# Altium project KeepTalking_PCB.PrjPcb (part 1 of 3)
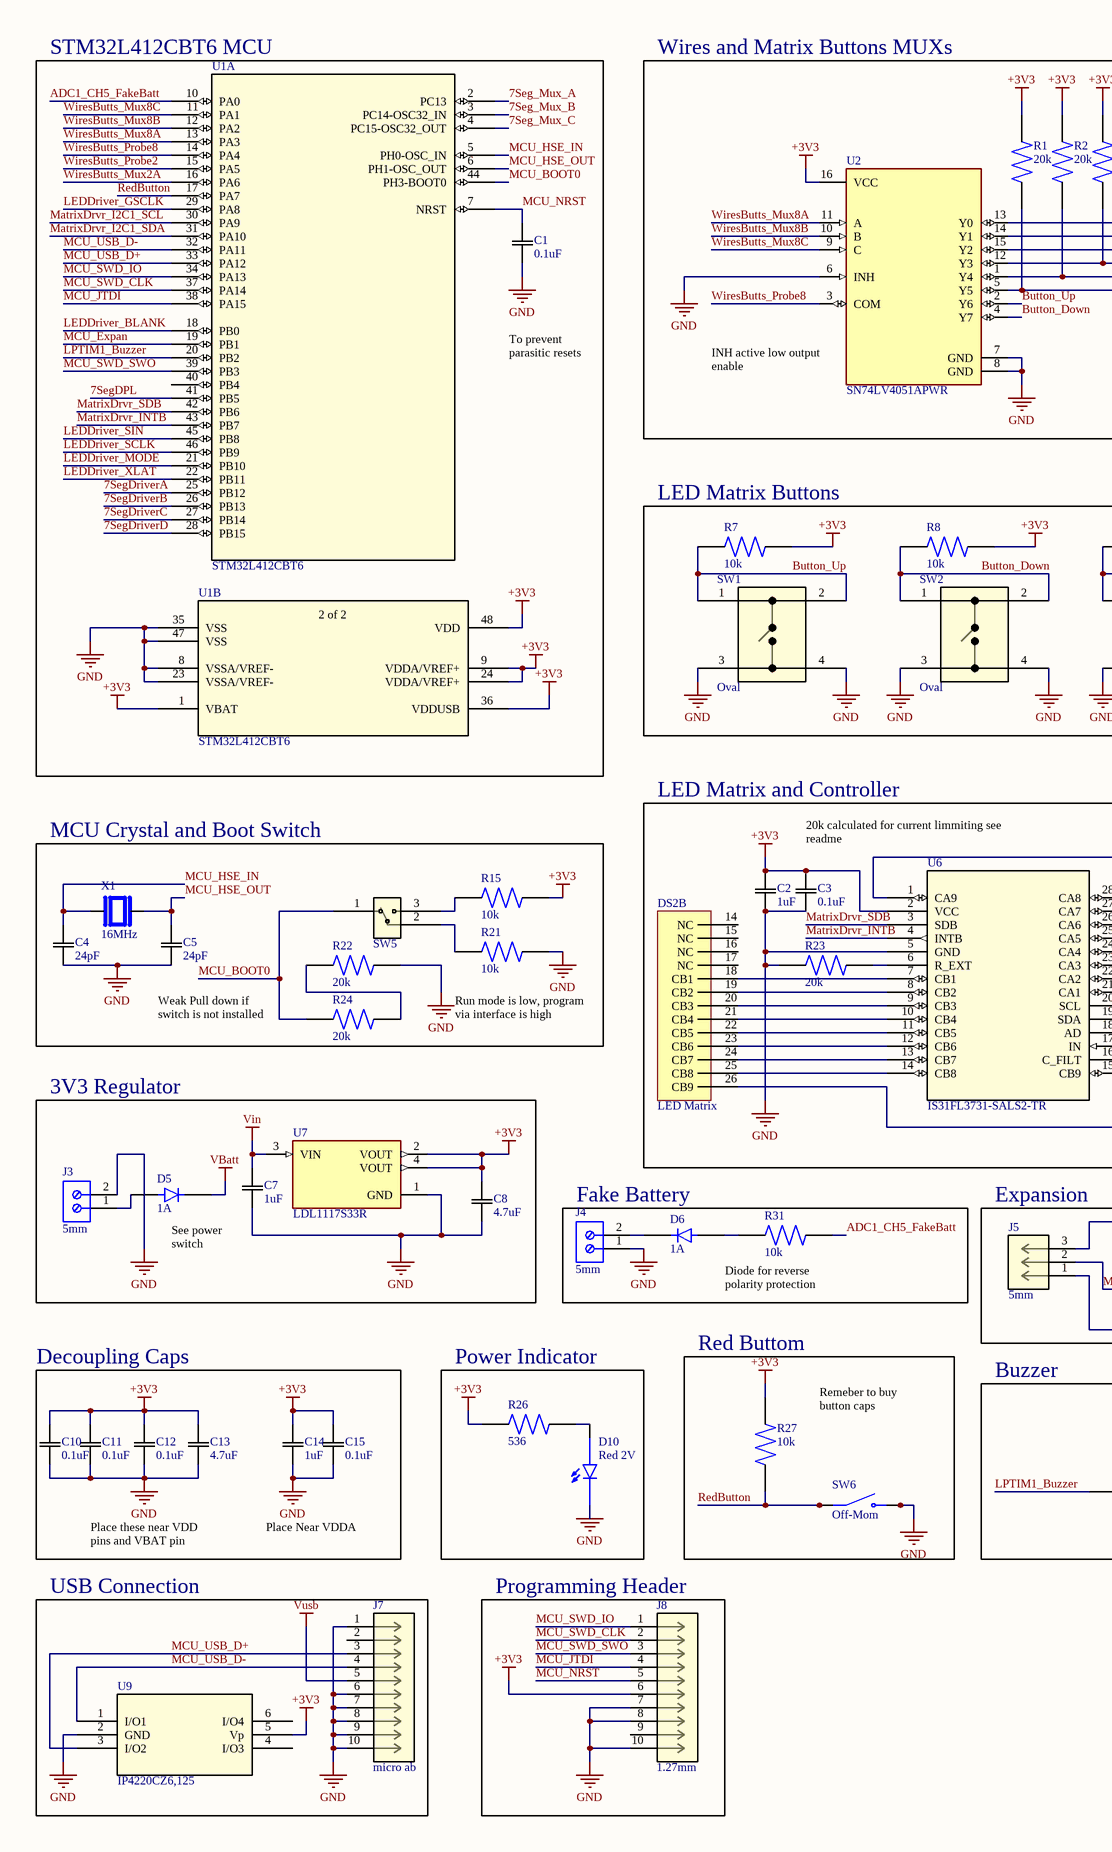
[diagram p0: TopLevel.SchDoc, left]
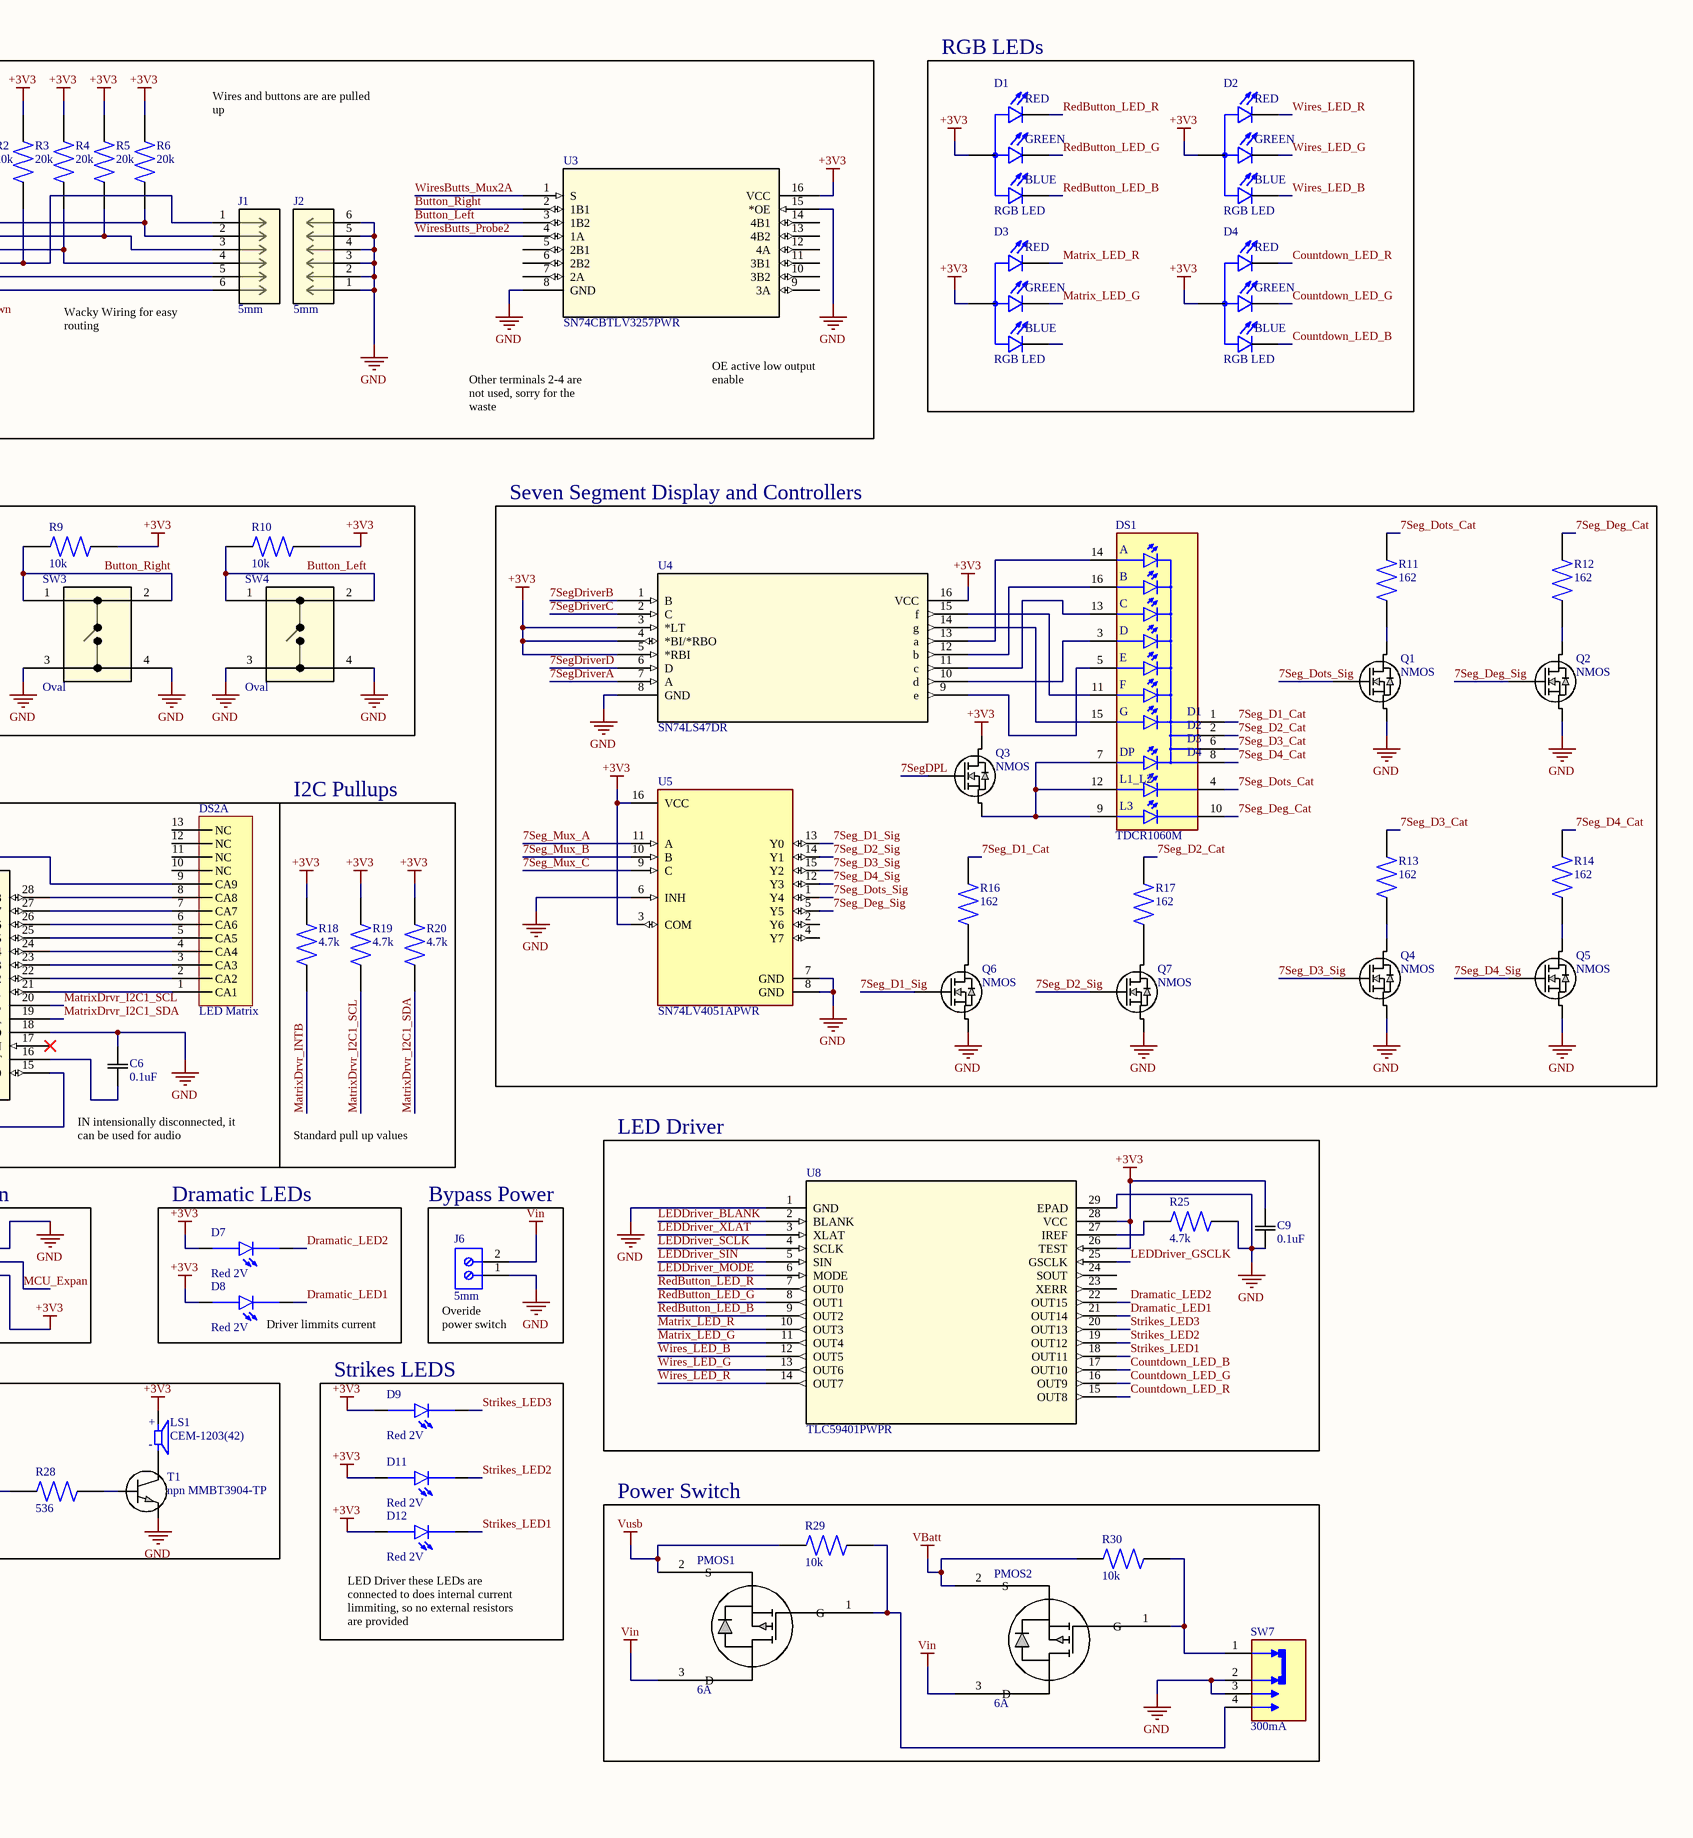
[diagram p1: TopLevel.SchDoc, right]
1 sheet, 96 parts. Net scope: global (net labels, ports and power ports of the same name join across sheets).
Board file: PCB1_wGraphics.PcbDoc

## Sheet TopLevel.SchDoc
size 584 x 355 mm; SheetNumber: 1; SheetTotal: 1

### Parts
C1  0.1uF  [0805]
C2  1uF  [0805]
C3  0.1uF  [0805]
C4  24pF  [0805]
C5  24pF  [0805]
C6  0.1uF  [0805]
C7  1uF  [0805]
C8  4.7uF  [0805]
C9  0.1uF  [0805]
C10  0.1uF  [0805]
C11  0.1uF  [0805]
C12  0.1uF  [0805]
C13  4.7uF  [0805]
C14  1uF  [0805]
C15  0.1uF  [0805]
D1  RGB LED  [RBG LED 4-SMD]
D2  RGB LED  [RBG LED 4-SMD]
D3  RGB LED  [RBG LED 4-SMD]
D4  RGB LED  [RBG LED 4-SMD]
D5  1A  [SOD-123F Diode Schottky]
D6  1A  [SOD-123F Diode Schottky]
D7  Red 2V  [0805]
D8  Red 2V  [0805]
D9  Red 2V  [0805]
D10  Red 2V  [0805]
D11  Red 2V  [0805]
D12  Red 2V  [0805]
DS1  TDCR1060M  [16-DIP 4Char-7Seg]
DS2  LED Matrix  [LED Matrix 9x16 Charlie]  (parts A,B of 2)
J1  5mm  [CON 6pos Screw 5.00mm]
J2  5mm  [CON 6pos Screw 5.00mm]
J3  5mm  [Con 2Pos Screw 5.00mm]
J4  5mm  [Con 2Pos Screw 5.00mm]
J5  5mm  [CONN 3pos 5.00mm]
J6  5mm  [Con 2Pos Screw 5.00mm]
J7  micro ab  [USB micro ab 0475900001]
J8  1.27mm  [Con 10pin 2Row 1.27mm]
LS1  CEM-1203(42)  [Buzzer CEM-1203(42)]
PMOS1  6A  [SOT-23F MOS PMOS 30V 6A]
PMOS2  6A  [SOT-23F MOS PMOS 30V 6A]
Q1  NMOS  [SOT-323 MOS]
Q2  NMOS  [SOT-323 MOS]
Q3  NMOS  [SOT-323 MOS]
Q4  NMOS  [SOT-323 MOS]
Q5  NMOS  [SOT-323 MOS]
Q6  NMOS  [SOT-323 MOS]
Q7  NMOS  [SOT-323 MOS]
R1  20k  [0805]
R2  20k  [0805]
R3  20k  [0805]
R4  20k  [0805]
R5  20k  [0805]
R6  20k  [0805]
R7  10k  [0805]
R8  10k  [0805]
R9  10k  [0805]
R10  10k  [0805]
R11  162  [0805]
R12  162  [0805]
R13  162  [0805]
R14  162  [0805]
R15  10k  [0805]
R16  162  [0805]
R17  162  [0805]
R18  4.7k  [0805]
R19  4.7k  [0805]
R20  4.7k  [0805]
R21  10k  [0805]
R22  20k  [0805]
R23  20k  [0805]
R24  20k  [0805]
R25  4.7k  [0805]
R26  536  [0805]
R27  10k  [0805]
R28  536  [0805]
R29  10k  [0805]
R30  10k  [0805]
R31  10k  [0805]
SW1  Oval  [Oval Button]
SW2  Oval  [Oval Button]
SW3  Oval  [Oval Button]
SW4  Oval  [Oval Button]
SW5  OS102011MA1QN1  [OS102011MA1QN1]  (value not drawn)
SW6  Off-Mom  [Switch off-Mom]
SW7  300mA  [Switch On-On-On 300mA SLW-1277545-2A-RA-S-D]
T1  npn MMBT3904-TP  [SOT-23 Transistor]
U1  STM32L412CBT6  [48-LQFP]  (parts A,B of 2)
U2  SN74LV4051APWR  [16-TSSOP MUX 8to1]
U3  SN74CBTLV3257PWR  [16-TSSOP 1:2 switch SN74CBTLV3257PWR]
U4  SN74LS47DR  [16-SOIC 7-seg Driver]
U5  SN74LV4051APWR  [16-TSSOP MUX 8to1]
U6  IS31FL3731-SALS2-TR  [28-SSOP LED Matrix Driver]
U7  LDL1117S33R  [SOT-223 Lin Reg 3V3]
U8  TLC59401PWPR  [28-HTSSOP 16LED Driver]
U9  IP4220CZ6,125  [SOT-457 USB ESD]
X1  16MHz  [OSC 16MHz]

### Blocks framed on the sheet
STM32L412CBT6 MCU: C1 U1
Wires and Matrix Buttons MUXs: J1 J2 R1-R6 U2 U3
RGB LEDs: D1-D4
LED Matrix Buttons: R7-R10 SW1-SW4
Seven Segment Display and Controllers: DS1 Q1-Q7 R11-R14 R16 R17 U4 U5
LED Matrix and Controller: C2 C3 C6 DS2 R23 U6
MCU Crystal and Boot Switch: C4 C5 R15 R21 R22 R24 SW5 X1
3V3 Regulator: C7 C8 D5 J3 U7
LED Driver: C9 R25 U8
Fake Battery: D6 J4 R31
Expansion: J5
Dramatic LEDs: D7 D8
Bypass Power: J6
Red Buttom: R27 SW6
Decoupling Caps: C10-C15
Power Indicator: D10 R26
Buzzer: LS1 R28 T1
Strikes LEDS: D9 D11 D12
Power Switch: PMOS1 PMOS2 R29 R30 SW7
USB Connection: J7 U9
Programming Header: J8

### Nets
+3V3: C2.2 C3.2 C8.2 C9.2 C10.2 C11.2 C12.2 C13.2 C14.1 C15.2 D1.1(A) D2.1(A) D3.1(A) D4.1(A) D7.1(A) D8.1(A) D9.1(A) D11.1(A) D12.1(A) J5.1 J8.6 LS1.P Q3.2(D) R1.2 R2.2 R3.2 R4.2 R5.2 R6.2 R7.2 R8.2 R9.2 R10.2 R15.2 R18.2 R19.2 R20.2 R26.1 R27.2 U1.1(VBAT) U1.9(VDDA/VREF+) U1.24(VDDA/VREF+) U1.36(VDDUSB) U1.48(VDD) U2.16(VCC) U3.16(VCC) U4.3(*LT) U4.4(*BI/*RBO) U4.5(*RBI) U4.16(VCC) U5.3(COM) U5.16(VCC) U6.2(VCC) U7.2(VOUT) U7.4(VOUT) U8.26(TEST) U8.28(VCC) U9.5(Vp)
GND: C1.1 C2.1 C3.1 C4.1 C5.2 C6.2 C7.1 C8.1 C9.1 C10.1 C11.1 C12.1 C13.1 C14.2 C15.1 D10.2(C) J2.1 J2.2 J2.3 J2.4 J2.5 J2.6 J3.2 J4.1 J5.3 J6.1 J7.1(VBUS) J7.6(SHIELD) J7.7(SHIELD) J7.8(SHIELD) J7.9(SHIELD) J7.10(SHIELD) J8.7 J8.8 J8.10 Q1.3(S) Q2.3(S) Q4.3(S) Q5.3(S) Q6.3(S) Q7.3(S) R21.2 R22.1 R23.1 R25.2 SW1.3 SW1.4 SW2.3 SW2.4 SW3.3 SW3.4 SW4.3 SW4.4 SW6.3(NO) SW6.4(NO) SW7.2 SW7.3 T1.2 U1.8(VSSA/VREF-) U1.23(VSSA/VREF-) U1.35(VSS) U1.47(VSS) U2.6(INH) U2.7(GND) U2.8(GND) U3.8(GND) U3.15(*OE) U4.8(GND) U5.6(INH) U5.7(GND) U5.8(GND) U6.5(GND) U6.18(AD) U7.1(GND) U8.1(GND) U8.29(EPAD) U9.2(GND)
VBatt: D5.1(C) PMOS2.2(S) R30.1
Vin: C7.2 J6.2 PMOS1.3(D) PMOS2.3(D) U7.3(VIN)
Vusb: J7.5(GND) PMOS1.2(S) R29.1
7Seg_D1_Cat: DS1.1(D1) R16.2
7Seg_D1_Sig: Q6.1(G) U5.13(Y0)
7Seg_D2_Cat: DS1.2(D2) R17.2
7Seg_D2_Sig: Q7.1(G) U5.14(Y1)
7Seg_D3_Cat: DS1.6(D3) R13.2
7Seg_D3_Sig: Q4.1(G) U5.15(Y2)
7Seg_D4_Cat: DS1.8(D4) R14.2
7Seg_D4_Sig: Q5.1(G) U5.12(Y3)
7Seg_Deg_Cat: DS1.10 R12.2
7Seg_Deg_Sig: Q2.1(G) U5.5(Y5)
7Seg_Dots_Cat: DS1.4 R11.2
7Seg_Dots_Sig: Q1.1(G) U5.1(Y4)
7Seg_Mux_A: U1.2(PC13) U5.11(A)
7Seg_Mux_B: U1.3(PC14-OSC32_IN) U5.10(B)
7Seg_Mux_C: U1.4(PC15-OSC32_OUT) U5.9(C)
7SegDPL: Q3.1(G) U1.41(PB5)
7SegDriverA: U1.25(PB12) U4.7(A)
7SegDriverB: U1.26(PB13) U4.1(B)
7SegDriverC: U1.27(PB14) U4.2(C)
7SegDriverD: U1.28(PB15) U4.6(D)
ADC1_CH5_FakeBatt: R31.2 U1.10(PA0)
Button_Down: R8.1 SW2.1 SW2.2 U2.4(Y7)
Button_Left: R10.1 SW4.1 SW4.2 U3.3(1B2)
Button_Right: R9.1 SW3.1 SW3.2 U3.2(1B1)
Button_Up: R7.1 SW1.1 SW1.2 U2.2(Y6)
Countdown_LED_B: D4.2(B_C) U8.17(OUT10)
Countdown_LED_G: D4.3(G_C) U8.16(OUT9)
Countdown_LED_R: D4.4(R_C) U8.15(OUT8)
Dramatic_LED1: D8.2(C) U8.21(OUT14)
Dramatic_LED2: D7.2(C) U8.22(OUT15)
LEDDriver_BLANK: U1.18(PB0) U8.2(BLANK)
LEDDriver_GSCLK: U1.29(PA8) U8.25(GSCLK)
LEDDriver_MODE: U1.21(PB10) U8.6(MODE)
LEDDriver_SCLK: U1.46(PB9) U8.4(SCLK)
LEDDriver_SIN: U1.45(PB8) U8.5(SIN)
LEDDriver_XLAT: U1.22(PB11) U8.3(XLAT)
LPTIM1_Buzzer: R28.1 U1.20(PB2)
Matrix_LED_G: D3.3(G_C) U8.11(OUT4)
Matrix_LED_R: D3.4(R_C) U8.10(OUT3)
MatrixDrvr_I2C1_SCL: R19.1 U1.30(PA9) U6.20(SCL)
MatrixDrvr_I2C1_SDA: R20.1 U1.31(PA10) U6.19(SDA)
MatrixDrvr_INTB: R18.1 U1.43(PB7) U6.4(INTB)
MatrixDrvr_SDB: U1.42(PB6) U6.3(SDB)
MCU_BOOT0: R24.2 SW5.1 U1.44(PH3-BOOT0)
MCU_Expan: J5.2 U1.19(PB1)
MCU_HSE_IN: C4.2 U1.5(PH0-OSC_IN) X1.1
MCU_HSE_OUT: C5.1 U1.6(PH1-OSC_OUT) X1.2
MCU_JTDI: J8.4 U1.38(PA15)
MCU_NRST: C1.2 J8.5 U1.7(NRST)
MCU_SWD_CLK: J8.2 U1.37(PA14)
MCU_SWD_IO: J8.1 U1.34(PA13)
MCU_SWD_SWO: J8.3 U1.39(PB3)
MCU_USB_D+: J7.3(D+) U1.33(PA12) U9.3(I/O2)
MCU_USB_D-: J7.4(ID) U1.32(PA11) U9.1(I/O1)
RedButton: R27.1 SW6.1(COM) SW6.2(COM) U1.17(PA7)
RedButton_LED_B: D1.2(B_C) U8.9(OUT2)
RedButton_LED_G: D1.3(G_C) U8.8(OUT1)
RedButton_LED_R: D1.4(R_C) U8.7(OUT0)
Strikes_LED1: D12.2(C) U8.18(OUT11)
Strikes_LED2: D11.2(C) U8.19(OUT12)
Strikes_LED3: D9.2(C) U8.20(OUT13)
Wires_LED_B: D2.2(B_C) U8.12(OUT5)
Wires_LED_G: D2.3(G_C) U8.13(OUT6)
Wires_LED_R: D2.4(R_C) U8.14(OUT7)
WiresButts_Mux2A: U1.16(PA6) U3.1(S)
WiresButts_Mux8A: U1.13(PA3) U2.11(A)
WiresButts_Mux8B: U1.12(PA2) U2.10(B)
WiresButts_Mux8C: U1.11(PA1) U2.9(C)
WiresButts_Probe2: U1.15(PA5) U3.4(1A)
WiresButts_Probe8: U1.14(PA4) U2.3(COM)
NetC6_1: C6.1 U6.16(C_FILT)
NetD5_2: D5.2(A) J3.1
NetD6_1: D6.1(C) J4.2
NetD6_2: D6.2(A) R31.1
NetD10_1: D10.1(A) R26.2
NetDS1_3: DS1.3(D) U4.10(d)
NetDS1_5: DS1.5(E) U4.9(e)
NetDS1_7: DS1.7(DP) DS1.9(L3) DS1.12(L1_L2) Q3.3(S)
NetDS1_11: DS1.11(F) U4.15(f)
NetDS1_13: DS1.13(C) U4.11(c)
NetDS1_14: DS1.14(A) U4.13(a)
NetDS1_15: DS1.15(G) U4.14(g)
NetDS1_16: DS1.16(B) U4.12(b)
NetDS2_1: DS2.1(CA1) U6.21(CA1)
NetDS2_2: DS2.2(CA2) U6.22(CA2)
NetDS2_3: DS2.3(CA3) U6.23(CA3)
NetDS2_4: DS2.4(CA4) U6.24(CA4)
NetDS2_5: DS2.5(CA5) U6.25(CA5)
NetDS2_6: DS2.6(CA6) U6.26(CA6)
NetDS2_7: DS2.7(CA7) U6.27(CA7)
NetDS2_8: DS2.8(CA8) U6.28(CA8)
NetDS2_9: DS2.9(CA9) U6.1(CA9)
NetDS2_18: DS2.18(CB1) U6.7(CB1)
NetDS2_19: DS2.19(CB2) U6.8(CB2)
NetDS2_20: DS2.20(CB3) U6.9(CB3)
NetDS2_21: DS2.21(CB4) U6.10(CB4)
NetDS2_22: DS2.22(CB5) U6.11(CB5)
NetDS2_23: DS2.23(CB6) U6.12(CB6)
NetDS2_24: DS2.24(CB7) U6.13(CB7)
NetDS2_25: DS2.25(CB8) U6.14(CB8)
NetDS2_26: DS2.26(CB9) U6.15(CB9)
NetJ1_1: J1.1 R3.1 U2.12(Y3)
NetJ1_2: J1.2 R6.1 U2.13(Y0)
NetJ1_3: J1.3 R5.1 U2.14(Y1)
NetJ1_4: J1.4 R4.1 U2.15(Y2)
NetJ1_5: J1.5 R2.1 U2.1(Y4)
NetJ1_6: J1.6 R1.1 U2.5(Y5)
NetLS1_N: LS1.N T1.3
NetPMOS1_1: PMOS1.1(G) R29.2 SW7.4
NetPMOS2_1: PMOS2.1(G) R30.2 SW7.1
NetQ1_2: Q1.2(D) R11.1
NetQ2_2: Q2.2(D) R12.1
NetQ4_2: Q4.2(D) R13.1
NetQ5_2: Q5.2(D) R14.1
NetQ6_2: Q6.2(D) R16.1
NetQ7_2: Q7.2(D) R17.1
NetR15_1: R15.1 SW5.3
NetR21_1: R21.1 SW5.2
NetR22_2: R22.2 R24.1
NetR23_2: R23.2 U6.6(R_EXT)
NetR25_1: R25.1 U8.27(IREF)
NetR28_2: R28.2 T1.1

Not connected (* = marked no-connect by the designer): D3 2(B_C); DS2 10(NC) 11(NC) 12(NC) 13(NC) 14(NC) 15(NC) 16(NC) 17(NC); J7 2(D-); J8 9; U1 40(PB4); U3 5(2B1) 6(2B2) 7(2A) 9(3A) 10(3B2) 11(3B1) 12(4A) 13(4B2) 14(4B1); U5 2(Y6) 4(Y7); U6 17(IN)*; U8 23(XERR) 24(SOUT); U9 4(I/O3) 6(I/O4)

### Notes on the sheet
- Wires and buttons are are pulled up
- (near J1) Wacky Wiring for easy routing
- To prevent parasitic resets
- (near U2) INH active low output enable
- OE active low output enable
- Other terminals 2-4 are not used, sorry for the waste
- I2C Pullups
- 20k calculated for current limmiting see readme
- (near C5) Weak Pull down if switch is not installed
- (near R21) Run mode is low, program via interface is high
- (near C6) IN intensionally disconnected, it can be used for audio
- Standard pull up values
- See power switch
- Diode for reverse polarity protection
- (near D8) Driver limmits current
- (near J6) Overide power switch
- Remeber to buy button caps
- Place these near VDD pins and VBAT pin
- Place Near VDDA
- (near D12) LED Driver these LEDs are connected to does internal current limmiting, so no external resistors are provided
- (in symbol DI LED RGB ComAnode) RED; GREEN; BLUE
- (in symbol IC STM32L412CBT6, part B) 2 of 2
- (in symbol LS Buzzer CEM-1203(42)) +; -